# Altium schematic sheet Buck regulator.SchDoc
size A
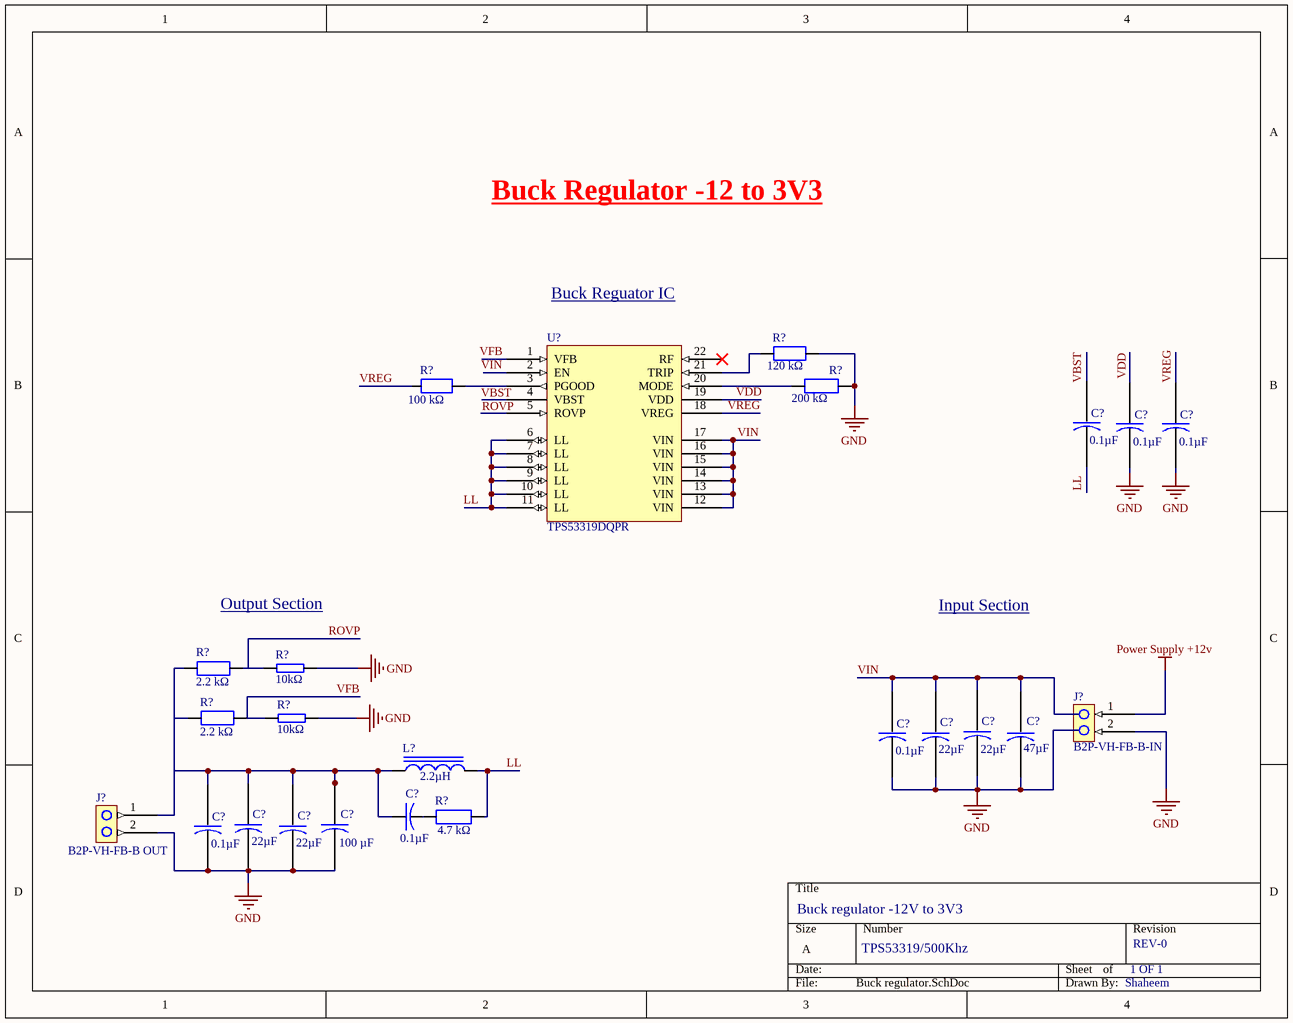
[diagram p0: Buck regulator.SchDoc]

## Parts
(Parts that share a designator on the sheet are numbered #1, #2 ... from top to bottom, then left to right.)
C?#1  0.1µF
C?#2  0.1µF
C?#3  0.1µF
C?#4  22µF
C?#5  22µF
C?#6  0.1µF
C?#7  47µF
C?#8  22µF
C?#9  22µF
C?#10  0.1µF
C?#11  100 µF
C?#12  0.1µF
J?#1  B2P-VH-FB-B-IN
J?#2  B2P-VH-FB-B OUT
L?  2.2µH
R?#1  120 kΩ
R?#2  100 kΩ
R?#3  200 kΩ
R?#4  2.2 kΩ  [RMCF0805FT2K20-2.2kohm Thick film resistor]
R?#5  10kΩ
R?#6  2.2 kΩ  [RMCF0805FT2K20-2.2kohm Thick film resistor]
R?#7  10kΩ
R?#8  4.7 kΩ
U?  TPS53319DQPR

## Nets
GND: C?#2.1 C?#3.1 C?#4.1 C?#5.1 C?#6.1 C?#7.1 C?#8.1 C?#9.1 C?#11.1 C?#12.1 J?#1.2 J?#2.2 R?#1.1 R?#3.2 R?#5.1 R?#7.1
Power Supply +12v: J?#1.1
LL: L?.2 R?#8.1
ROVP: R?#4.1 R?#5.2
VDD: C?#2.2 U?.19(VDD)
VFB: R?#6.1 R?#7.2
VIN: C?#4.2 C?#5.2 C?#6.2 C?#7.2 U?.12(VIN) U?.13(VIN) U?.14(VIN) U?.15(VIN) U?.16(VIN) U?.17(VIN)
VREG: R?#2.2 U?.18(VREG)
NetC?#8_2: C?#8.2 C?#9.2 C?#10.2 C?#11.2 C?#12.2 J?#2.1 L?.1 R?#4.2 R?#6.2
NetC?#10_1: C?#10.1 R?#8.2
NetR?#1_2: R?#1.2 U?.21(TRIP)
NetR?#2_1: R?#2.1 U?.3(PGOOD)
NetR?#3_1: R?#3.1 U?.20(MODE)
NetU?_6: U?.6(LL) U?.7(LL) U?.8(LL) U?.9(LL) U?.10(LL) U?.11(LL)

Not connected (* = marked no-connect by the designer): C?#1 1 2; C?#3 2; U? 1(VFB) 2(EN) 4(VBST) 5(ROVP) 22(RF)*

## Notes on the sheet
- Buck Regulator -12 to 3V3
- Buck Reguator IC
- Output Section
- Input Section
- Buck regulator -12V to 3V3
- TPS53319/500Khz
- 1 OF 1
- REV-0
- Shaheem
- Labels drawn without touching a wire or pin: LL, ROVP, VBST, VFB, VIN, VREG

## Library data of the parts
C?#1-C?#3 C?#6 C?#10 C?#12 = GRM155R71E104KE14J- 0.1 µF: 0402 0.1 uF 25 V ±10% Tolerance X7R SMT Multilayer Ceramic Capacitor; Manufacturer: Murata; Manufacturer Lifecycle Status: IN PRODUCTION; Value: 100nF; Voltage Rating: 25V; Supplier: DigiKey; Supplier Part Number: 490-14603-2-ND; Manufacturer Part Number: GRM155R71E104KE14J; RoHS: Compliant; Category: Ceramic Capacitors; Stock: 1424920; Pricing: 50000=0.00435, 100000=0.00402, 150000=0.00386, 250000=0.00368, 350000=0.00357, 500000=0.00347 (USD); Case/Package: 0402; Case Code (Imperial): 0402; Case Code (Metric): 1005; Composition: Ceramic; Dielectric: X7R; Dielectric Material: Ceramic; Height: 500µm; Length: 1mm; Lifecycle Status: Production; Material: Ceramic; Max Operating Temperature: 125°C; Min Operating Temperature: -55°C; Mounting Technology: Surface Mount; Pins: 2; Number of Terminals: 2; Packaging: Tape & Reel (TR); REACH SVHC: Yes; Schedule B: 8532240020, 8532240020|8532240020, 8532240020|8532240020|8532240020, 8532240020|8532240020|8532240020|8532240020; Termination: SMD/SMT; Thickness: 500µm; Tolerance: 10%; Voltage Rating (DC): 25V; Weight: 6.010099mg; Width: 500µm; ComponentLink1URL: https://datasheet.octopart.com:443/GRM155R71E104KE14J-Murata-datasheet-155345056.pdf?src-supplier=Newark; ComponentLink1Description: https://datasheet.octopart.com:443/GRM155R71E104KE14J-Murata-datasheet-155345056.pdf?src-supplier=Newark; ComponentLink2URL: https://datasheet.octopart.com:443/GRM155R71E104KE14J-Murata-datasheet-165579666.pdf?src-supplier=TME; ComponentLink2Description: https://datasheet.octopart.com:443/GRM155R71E104KE14J-Murata-datasheet-165579666.pdf?src-supplier=TME; ComponentLink3URL: https://datasheet.octopart.com:443/GRM155R71E104KE14J-Murata-datasheet-141266224.pdf?src-supplier=Ciiva; ComponentLink3Description: https://datasheet.octopart.com:443/GRM155R71E104KE14J-Murata-datasheet-141266224.pdf?src-supplier=Ciiva; ComponentLink4URL: https://datasheet.octopart.com:443/GRM155R71E104KE14J-Murata-datasheet-140691366.pdf?src-supplier=Ciiva; ComponentLink4Description: https://datasheet.octopart.com:443/GRM155R71E104KE14J-Murata-datasheet-140691366.pdf?src-supplier=Ciiva; ComponentLink5URL: https://datasheet.octopart.com:443/GRM155R71E104KE14J-Murata-datasheet-138740936.pdf?src-supplier=Ciiva; ComponentLink5Description: https://datasheet.octopart.com:443/GRM155R71E104KE14J-Murata-datasheet-138740936.pdf?src-supplier=Ciiva; ComponentLink6URL: https://datasheet.octopart.com/GRM155R71E104KE14J-Murata-datasheet-12515295.pdf; ComponentLink6Description: https://datasheet.octopart.com/GRM155R71E104KE14J-Murata-datasheet-12515295.pdf; ComponentLink7URL: https://datasheet.octopart.com/GRM155R71E104KE14J-Murata-datasheet-12510076.pdf; ComponentLink7Description: https://datasheet.octopart.com/GRM155R71E104KE14J-Murata-datasheet-12510076.pdf; ComponentLink8URL: https://datasheet.octopart.com/GRM155R71E104KE14J-Murata-datasheet-11978611.pdf; ComponentLink8Description: https://datasheet.octopart.com/GRM155R71E104KE14J-Murata-datasheet-11978611.pdf; ComponentLink9URL: https://datasheet.octopart.com/GRM155R71E104KE14J-Murata-datasheet-10025737.pdf; ComponentLink9Description: https://datasheet.octopart.com/GRM155R71E104KE14J-Murata-datasheet-10025737.pdf; ComponentLink10URL: https://datasheet.octopart.com/GRM155R71E104KE14J-Murata-datasheet-8819587.pdf; ComponentLink10Description: https://datasheet.octopart.com/GRM155R71E104KE14J-Murata-datasheet-8819587.pdf; ComponentLink11URL: https://datasheet.octopart.com/GRM155R71E104KE14J-Murata-datasheet-15634843.pdf; ComponentLink11Description: https://datasheet.octopart.com/GRM155R71E104KE14J-Murata-datasheet-15634843.pdf; ComponentLink12URL: https://datasheet.octopart.com:443/GRM155R71E104KE14J-Murata-datasheet-144363483.pdf?src-supplier=Arrow.cn; ComponentLink12Description: https://datasheet.octopart.com:443/GRM155R71E104KE14J-Murata-datasheet-144363483.pdf?src-supplier=Arrow.cn; ComponentLink13URL: http://sigma.octopart.com:80/reach_statement/Murata-company-16.pdf?src-supplier=Compliance+Statements; ComponentLink13Description: http://sigma.octopart.com:80/reach_statement/Murata-company-16.pdf?src-supplier=Compliance+Statements; Supplier 1: DigiKey; Supplier Part Number 1: 490-14603-1-ND
C?#4 C?#5 C?#8 C?#9 = GRM32ER71E226KE15L-22 µF: 25V 22µF X7R ±10% 1210 Multilayer Ceramic Capacitors MLCC - SMD/SMT ROHS; Manufacturer: Murata; Manufacturer Lifecycle Status: IN PRODUCTION; Color: Black; Current Rating: 3A; Gender: Male; Supplier: DigiKey; Supplier Part Number: 490-5313-6-ND; Manufacturer Part Number: GRM32ER71E226KE15L; RoHS: Compliant; Category: Ceramic Capacitors; Stock: 107975; Pricing: 1=0.76, 10=0.477, 50=0.3648, 100=0.3303, 500=0.27204 (USD); Value: 22µF; Case/Package: 1210; Case Code (Imperial): 1210; Case Code (Metric): 3225; Contact Material: Bronze; Contact Plating: Gold; Country of Origin: Singapore; Depth: 2.5mm; Dielectric: X7R; Dielectric Material: Ceramic; Export Control Classification Number (ECCN) Code: EAR99; Height: 2.5mm; Harmonized Tariff Schedule (HTS) Code: 8532.24.00.20; Introduction Date: 2009-02-19; Lead Free: Lead Free; Lead Pitch: 2.54mm; Length: 3.2mm; Lifecycle Status: Production; Material: Ceramic; Max Operating Temperature: 125°C; Min Operating Temperature: -55°C; Mounting Technology: Surface Mount; Pins: 2; Number of Terminals: 2; Packaging: Cut Tape; Radiation Hardening: No; REACH SVHC: Yes; Schedule B: 8532240020, 8532240020|8532240020, 8532240020|8532240020|8532240020, 8532240020|8532240020|8532240020|8532240020; Termination: SMD/SMT; Thickness: 2.5mm; Tolerance: 10%; Voltage: 25V; Voltage Rating: 25V; Voltage Rating (DC): 25V; Width: 2.5mm; ComponentLink1URL: https://datasheet.octopart.com:443/GRM32ER71E226KE15L-Murata-datasheet-141422401.pdf?src-supplier=Upverter; ComponentLink1Description: https://datasheet.octopart.com:443/GRM32ER71E226KE15L-Murata-datasheet-141422401.pdf?src-supplier=Upverter; ComponentLink2URL: https://datasheet.octopart.com:443/GRM32ER71E226KE15L-Murata-datasheet-12536533.pdf?src-supplier=Factory+Futures; ComponentLink2Description: https://datasheet.octopart.com:443/GRM32ER71E226KE15L-Murata-datasheet-12536533.pdf?src-supplier=Factory+Futures; ComponentLink3URL: https://datasheet.octopart.com:443/GRM32ER71E226KE15L-Murata-datasheet-62317415.pdf?src-supplier=element14+APAC; ComponentLink3Description: https://datasheet.octopart.com:443/GRM32ER71E226KE15L-Murata-datasheet-62317415.pdf?src-supplier=element14+APAC; ComponentLink4URL: https://datasheet.octopart.com:443/GRM32ER71E226KE15L-Murata-datasheet-14713250.pdf?src-supplier=element14+APAC; ComponentLink4Description: https://datasheet.octopart.com:443/GRM32ER71E226KE15L-Murata-datasheet-14713250.pdf?src-supplier=element14+APAC; ComponentLink5URL: https://datasheet.octopart.com:443/GRM32ER71E226KE15L-Murata-datasheet-141281608.pdf?src-supplier=Geoflip; ComponentLink5Description: https://datasheet.octopart.com:443/GRM32ER71E226KE15L-Murata-datasheet-141281608.pdf?src-supplier=Geoflip; ComponentLink6URL: https://datasheet.octopart.com:443/GRM32ER71E226KE15L-Murata-datasheet-8814637.pdf?src-supplier=Newark; ComponentLink6Description: https://datasheet.octopart.com:443/GRM32ER71E226KE15L-Murata-datasheet-8814637.pdf?src-supplier=Newark; ComponentLink7URL: https://datasheet.octopart.com:443/GRM32ER71E226KE15L-Murata-datasheet-14403038.pdf?src-supplier=Future+Electronics; ComponentLink7Description: https://datasheet.octopart.com:443/GRM32ER71E226KE15L-Murata-datasheet-14403038.pdf?src-supplier=Future+Electronics; ComponentLink8URL: https://datasheet.octopart.com:443/GRM32ER71E226KE15L-Murata-datasheet-22122223.pdf?src-supplier=Future+Electronics; ComponentLink8Description: https://datasheet.octopart.com:443/GRM32ER71E226KE15L-Murata-datasheet-22122223.pdf?src-supplier=Future+Electronics; ComponentLink9URL: https://datasheet.octopart.com:443/GRM32ER71E226KE15L-Murata-datasheet-165579666.pdf?src-supplier=TME; ComponentLink9Description: https://datasheet.octopart.com:443/GRM32ER71E226KE15L-Murata-datasheet-165579666.pdf?src-supplier=TME; ComponentLink10URL: https://datasheet.octopart.com:443/GRM32ER71E226KE15L-Murata-datasheet-59876780.pdf?src-supplier=TME; ComponentLink10Description: https://datasheet.octopart.com:443/GRM32ER71E226KE15L-Murata-datasheet-59876780.pdf?src-supplier=TME; ComponentLink11URL: https://datasheet.octopart.com:443/GRM32ER71E226KE15L-Murata-datasheet-140709638.pdf?src-supplier=Ciiva; ComponentLink11Description: https://datasheet.octopart.com:443/GRM32ER71E226KE15L-Murata-datasheet-140709638.pdf?src-supplier=Ciiva; ComponentLink12URL: https://datasheet.octopart.com:443/GRM32ER71E226KE15L-Murata-datasheet-138747041.pdf?src-supplier=Ciiva; ComponentLink12Description: https://datasheet.octopart.com:443/GRM32ER71E226KE15L-Murata-datasheet-138747041.pdf?src-supplier=Ciiva; ComponentLink13URL: https://datasheet.octopart.com/GRM32ER71E226KE15L-Murata-datasheet-12515295.pdf; ComponentLink13Description: https://datasheet.octopart.com/GRM32ER71E226KE15L-Murata-datasheet-12515295.pdf; ComponentLink14URL: https://datasheet.octopart.com/GRM32ER71E226KE15L-Murata-datasheet-12510076.pdf; ComponentLink14Description: https://datasheet.octopart.com/GRM32ER71E226KE15L-Murata-datasheet-12510076.pdf; ComponentLink15URL: https://datasheet.octopart.com/GRM32ER71E226KE15L-Murata-datasheet-11978611.pdf; ComponentLink15Description: https://datasheet.octopart.com/GRM32ER71E226KE15L-Murata-datasheet-11978611.pdf; ComponentLink16URL: https://datasheet.octopart.com/GRM32ER71E226KE15L-Murata-datasheet-10025737.pdf; ComponentLink16Description: https://datasheet.octopart.com/GRM32ER71E226KE15L-Murata-datasheet-10025737.pdf; ComponentLink17URL: https://datasheet.octopart.com/GRM32ER71E226KE15L-Murata-datasheet-8819587.pdf; ComponentLink17Description: https://datasheet.octopart.com/GRM32ER71E226KE15L-Murata-datasheet-8819587.pdf; ComponentLink18URL: http://sigma.octopart.com:80/reach_statement/Murata-company-16.pdf?src-supplier=Compliance+Statements; ComponentLink18Description: http://sigma.octopart.com:80/reach_statement/Murata-company-16.pdf?src-supplier=Compliance+Statements; Supplier 1: DigiKey; Supplier Part Number 1: 490-5313-6-ND
C?#7 = A768EB476M1ELAS042: Tant Poly Cap, 47 Uf, 25V, 1.175A, Solder Rohs Compliant: Yes |Kemet A768EB476M1ELAS042; Manufacturer: Yageo Group; ESR (Equivalent Series Resistance): 42mΩ; Leakage Current: 235µA; Ripple Current: 58.75mA; ComponentLink6URL: https://datasheet.octopart.com:443/EEHZK1E471P-Panasonic-datasheet-137716607.pdf?src-supplier=TME; ComponentLink6Description: https://datasheet.octopart.com:443/EEHZK1E471P-Panasonic-datasheet-137716607.pdf?src-supplier=TME; Supplier: DigiKey; Supplier Part Number: 399-A768EB476M1ELAS042CT-ND; Manufacturer Part Number: A768EB476M1ELAS042; RoHS: Compliant; Category: Aluminum Electrolytic Capacitors; Stock: 8816; Pricing: 1=0.54, 10=0.337, 50=0.2494, 100=0.2218, 500=0.17396 (USD); Value: 47µF; Export Control Classification Number (ECCN) Code: EAR99; Height: 5.7mm; Introduction Date: 2020-02-04; Length: 6.6mm; Lifecycle Status: Production; Max Operating Temperature: 125°C; Min Operating Temperature: -55°C; Mounting Technology: Surface Mount; Number of Terminals: 2; Ratings: AEC-Q200; REACH SVHC: Yes; Voltage Rating (DC): 25V; Width: 6.6mm; ComponentLink1URL: https://datasheet.octopart.com:443/A768EB476M1ELAS042-KEMET-datasheet-182036773.pdf?src-supplier=IHS; ComponentLink1Description: https://datasheet.octopart.com:443/A768EB476M1ELAS042-KEMET-datasheet-182036773.pdf?src-supplier=IHS; ComponentLink2URL: https://datasheet.octopart.com:443/A768EB476M1ELAS042-KEMET-datasheet-192944601.pdf?src-supplier=element14+APAC; ComponentLink2Description: https://datasheet.octopart.com:443/A768EB476M1ELAS042-KEMET-datasheet-192944601.pdf?src-supplier=element14+APAC; Supplier 1: DigiKey; Supplier Part Number 1: 399-A768EB476M1ELAS042CT-ND
C?#11 = RSL0J101MCN1GB: Cap Aluminum Polymer 100uF 6.3VDC 20% (6.3 X 4.2mm) SMD 0.018 Ohm 3200mA 2000h 105C T/R; Manufacturer: KYOCERA AVX; Value: 100µF; Dissipation Factor: 0.12%; ESR (Equivalent Series Resistance): 18mΩ; Leakage Current: 315µA; Life (Hours): 2000hours; Ripple Current: 320mA; Ripple Current (AC): 3.2A; Voltage Rating: 6.3V; Supplier: DigiKey; Supplier Part Number: 493-3819-2-ND; Manufacturer Part Number: RSL0J101MCN1GB; RoHS: Compliant; Category: Aluminum Electrolytic Capacitors; Stock: 490; Pricing: 1000=0.4217, 2000=0.39459, 3000=0.38092, 5000=0.36567, 7000=0.35671, 10000=0.34806 (USD); Case/Package: Radial; China RoHS: Compliant; Country of Origin: Mainland China; Diameter: 6.3mm; Export Control Classification Number (ECCN) Code: EAR99; Height: 4.2mm; Height - Seated (Max): 4.191mm; Harmonized Tariff Schedule (HTS) Code: 8532.22.00; Introduction Date: 2009-11-05; Length: 6.5mm; Lifecycle Status: Production; Max Operating Temperature: 105°C; Min Operating Temperature: -55°C; Mounting Technology: Surface Mount; Number of Terminals: 2; Packaging: Tape & Reel; REACH SVHC: Yes; Schedule B: 8532220020; Termination: SMD/SMT; Tolerance: 20%; Voltage Rating (DC): 6.3V; Width: 6.5mm; ComponentLink1URL: https://datasheet.octopart.com:443/RSL0J101MCN1GB-Nichicon-datasheet-169479674.pdf?src-supplier=IHS; ComponentLink1Description: https://datasheet.octopart.com:443/RSL0J101MCN1GB-Nichicon-datasheet-169479674.pdf?src-supplier=IHS; ComponentLink2URL: https://datasheet.octopart.com:443/RSL0J101MCN1GB-Nichicon-datasheet-12517196.pdf?src-supplier=Newark; ComponentLink2Description: https://datasheet.octopart.com:443/RSL0J101MCN1GB-Nichicon-datasheet-12517196.pdf?src-supplier=Newark; ComponentLink3URL: https://datasheet.octopart.com:443/RSL0J101MCN1GB-Nichicon-datasheet-65933903.pdf?src-supplier=Newark; ComponentLink3Description: https://datasheet.octopart.com:443/RSL0J101MCN1GB-Nichicon-datasheet-65933903.pdf?src-supplier=Newark; ComponentLink4URL: https://datasheet.octopart.com:443/RSL0J101MCN1GB-Nichicon-datasheet-182387194.pdf?src-supplier=Future+Electronics; ComponentLink4Description: https://datasheet.octopart.com:443/RSL0J101MCN1GB-Nichicon-datasheet-182387194.pdf?src-supplier=Future+Electronics; ComponentLink5URL: https://datasheet.octopart.com:443/RSL0J101MCN1GB-Nichicon-datasheet-161351370.pdf?src-supplier=Future+Electronics; ComponentLink5Description: https://datasheet.octopart.com:443/RSL0J101MCN1GB-Nichicon-datasheet-161351370.pdf?src-supplier=Future+Electronics; ComponentLink6URL: https://datasheet.octopart.com:443/RSL0J101MCN1GB-Nichicon-datasheet-145428908.pdf?src-supplier=Nichicon+SCT; ComponentLink6Description: https://datasheet.octopart.com:443/RSL0J101MCN1GB-Nichicon-datasheet-145428908.pdf?src-supplier=Nichicon+SCT; ComponentLink7URL: https://datasheet.octopart.com:443/RSL0J101MCN1GB-Nichicon-datasheet-140570125.pdf?src-supplier=Arrow.cn; ComponentLink7Description: https://datasheet.octopart.com:443/RSL0J101MCN1GB-Nichicon-datasheet-140570125.pdf?src-supplier=Arrow.cn; Supplier 1: DigiKey; Supplier Part Number 1: 493-3819-2-ND
J?#1 = B2P-VH-FB-B: Conn Shrouded Header (4 Sides) HDR 2 POS 3.96mm Solder ST Top Entry Thru-Hole Box; Manufacturer: JST; Manufacturer Part Number: B2P-VH-FB-B(LF)(SN); Connector Type: Male Pin; Current Rating: 10A; Gender: Male; Number of Contacts: 2; Pitch: 3.9624mm; Voltage Rating: 250V; Supplier 1: Future Electronics; Supplier Part Number 1: B2P-VH-FB-B(LF)(SN); Supplier: Future Electronics; Supplier Part Number: B2P-VH-FB-B(LF)(SN); RoHS: Compliant; Category: Headers and Wire Housings; Stock: 2504; Pricing: 250=0.11, 1000=0.106, 2500=0.104, 6250=0.101, 10000=0.0975 (USD); China RoHS: Compliant; Color: Natural; Contact Material: Brass; Contact Plating: Tin; Country of Origin: Indonesia; Export Control Classification Number (ECCN) Code: EAR99; Fastening Type: Ramp; Height: 11mm; Harmonized Tariff Schedule (HTS) Code: 8536.69.40.40; Introduction Date: 2010-03-26; Lead Free: Lead Free; Lifecycle Status: Production; Max Operating Temperature: 85°C; Min Operating Temperature: -25°C; Mounting Technology: Through Hole; Pins: 2; Number of Positions: 2; Number of Rows: 1; Orientation: Straight; REACH SVHC: Yes; Terminal Pitch: 3.96mm; Termination: Solder; ComponentLink1URL: https://datasheet.octopart.com:443/B2P-VH-FB-B%28LF%29%28SN%29-JST-datasheet-41193408.pdf?src-supplier=IHS; ComponentLink1Description: https://datasheet.octopart.com:443/B2P-VH-FB-B%28LF%29%28SN%29-JST-datasheet-41193408.pdf?src-supplier=IHS; ComponentLink2URL: https://datasheet.octopart.com:443/B2P-VH-FB-B%28LF%29%28SN%29-JST-datasheet-151658475.pdf?src-supplier=LKR; ComponentLink2Description: https://datasheet.octopart.com:443/B2P-VH-FB-B%28LF%29%28SN%29-JST-datasheet-151658475.pdf?src-supplier=LKR; ComponentLink3URL: https://datasheet.octopart.com:443/B2P-VH-FB-B%28LF%29%28SN%29-JST-datasheet-12513069.pdf?src-supplier=Future+Electronics; ComponentLink3Description: https://datasheet.octopart.com:443/B2P-VH-FB-B%28LF%29%28SN%29-JST-datasheet-12513069.pdf?src-supplier=Future+Electronics; ComponentLink4URL: https://datasheet.octopart.com:443/B2P-VH-FB-B%28LF%29%28SN%29-JST-datasheet-10025879.pdf?src-supplier=Future+Electronics; ComponentLink4Description: https://datasheet.octopart.com:443/B2P-VH-FB-B%28LF%29%28SN%29-JST-datasheet-10025879.pdf?src-supplier=Future+Electronics; ComponentLink5URL: https://datasheet.octopart.com:443/B2P-VH-FB-B%28LF%29%28SN%29-JST-datasheet-5332680.pdf?src-supplier=Future+Electronics; ComponentLink5Description: https://datasheet.octopart.com:443/B2P-VH-FB-B%28LF%29%28SN%29-JST-datasheet-5332680.pdf?src-supplier=Future+Electronics; ComponentLink6URL: https://datasheet.octopart.com:443/B2P-VH-FB-B%28LF%29%28SN%29-JST-datasheet-16979.pdf?src-supplier=Future+Electronics; ComponentLink6Description: https://datasheet.octopart.com:443/B2P-VH-FB-B%28LF%29%28SN%29-JST-datasheet-16979.pdf?src-supplier=Future+Electronics
J?#2 = B2P-VH-FB-B OUT: Conn Shrouded Header (4 Sides) HDR 2 POS 3.96mm Solder ST Top Entry Thru-Hole Box; Manufacturer: JST; Manufacturer Part Number: B2P-VH-FB-B(LF)(SN); Connector Type: Male Pin; Current Rating: 10A; Gender: Male; Number of Contacts: 2; Pitch: 3.9624mm; Voltage Rating: 250V; Supplier: Future Electronics; Supplier Part Number: B2P-VH-FB-B(LF)(SN); RoHS: Compliant; Category: Headers and Wire Housings; Stock: 2504; Pricing: 250=0.11, 1000=0.106, 2500=0.104, 6250=0.101, 10000=0.0975 (USD); China RoHS: Compliant; Color: Natural; Contact Material: Brass; Contact Plating: Tin; Country of Origin: Indonesia; Export Control Classification Number (ECCN) Code: EAR99; Fastening Type: Ramp; Height: 11mm; Harmonized Tariff Schedule (HTS) Code: 8536.69.40.40; Introduction Date: 2010-03-26; Lead Free: Lead Free; Lifecycle Status: Production; Max Operating Temperature: 85°C; Min Operating Temperature: -25°C; Mounting Technology: Through Hole; Pins: 2; Number of Positions: 2; Number of Rows: 1; Orientation: Straight; REACH SVHC: Yes; Terminal Pitch: 3.96mm; Termination: Solder; ComponentLink1URL: https://datasheet.octopart.com:443/B2P-VH-FB-B%28LF%29%28SN%29-JST-datasheet-41193408.pdf?src-supplier=IHS; ComponentLink1Description: https://datasheet.octopart.com:443/B2P-VH-FB-B%28LF%29%28SN%29-JST-datasheet-41193408.pdf?src-supplier=IHS; ComponentLink2URL: https://datasheet.octopart.com:443/B2P-VH-FB-B%28LF%29%28SN%29-JST-datasheet-151658475.pdf?src-supplier=LKR; ComponentLink2Description: https://datasheet.octopart.com:443/B2P-VH-FB-B%28LF%29%28SN%29-JST-datasheet-151658475.pdf?src-supplier=LKR; ComponentLink3URL: https://datasheet.octopart.com:443/B2P-VH-FB-B%28LF%29%28SN%29-JST-datasheet-12513069.pdf?src-supplier=Future+Electronics; ComponentLink3Description: https://datasheet.octopart.com:443/B2P-VH-FB-B%28LF%29%28SN%29-JST-datasheet-12513069.pdf?src-supplier=Future+Electronics; ComponentLink4URL: https://datasheet.octopart.com:443/B2P-VH-FB-B%28LF%29%28SN%29-JST-datasheet-10025879.pdf?src-supplier=Future+Electronics; ComponentLink4Description: https://datasheet.octopart.com:443/B2P-VH-FB-B%28LF%29%28SN%29-JST-datasheet-10025879.pdf?src-supplier=Future+Electronics; ComponentLink5URL: https://datasheet.octopart.com:443/B2P-VH-FB-B%28LF%29%28SN%29-JST-datasheet-5332680.pdf?src-supplier=Future+Electronics; ComponentLink5Description: https://datasheet.octopart.com:443/B2P-VH-FB-B%28LF%29%28SN%29-JST-datasheet-5332680.pdf?src-supplier=Future+Electronics; ComponentLink6URL: https://datasheet.octopart.com:443/B2P-VH-FB-B%28LF%29%28SN%29-JST-datasheet-16979.pdf?src-supplier=Future+Electronics; ComponentLink6Description: https://datasheet.octopart.com:443/B2P-VH-FB-B%28LF%29%28SN%29-JST-datasheet-16979.pdf?src-supplier=Future+Electronics; Supplier 1: Future Electronics; Supplier Part Number 1: B2P-VH-FB-B(LF)(SN)
L? = 0640CDMCCDS-2R2MC: Inductor Power Shielded/Molded Wirewound 2.2uH 20% 100KHz Metal 12A 0.0108Ohm DCR T/R; Manufacturer: Sumida; DC Resistance (DCR): 10.8mΩ; Number of Circuits: 1; Supplier: DigiKey; Supplier Part Number: 308-0640CDMCCDS-2R2MCCT-ND; Manufacturer Part Number: 0640CDMCCDS-2R2MC; RoHS: Compliant; Category: Fixed Inductors; Stock: 4702; Pricing: 1=0.78, 10=0.642, 100=0.5283 (USD); Case/Package: 2826; Height: 3.8mm; Value: 2.2µH; Length: 7mm; Lifecycle Status: Production; Max Current Rating: 12A; Max Operating Temperature: 125°C; Min Operating Temperature: -55°C; Number of Terminals: 2; Shielding: Shielded; Test Frequency: 100kHz; Tolerance: 20%; Width: 6.6mm; ComponentLink1URL: https://datasheet.octopart.com:443/0640CDMCCDS-2R2MC-Sumida-datasheet-181250634.pdf?src-supplier=IHS; ComponentLink1Description: https://datasheet.octopart.com:443/0640CDMCCDS-2R2MC-Sumida-datasheet-181250634.pdf?src-supplier=IHS; Supplier 1: DigiKey; Supplier Part Number 1: 308-0640CDMCCDS-2R2MCCT-ND
R?#1 = RC0603JR-07120KL: 120 kOhms ±5% 0.1W, 1/10W Chip Resistor 0603 (1608 Metric) Moisture Resistant Thick Film; Supplier 1: DigiKey; Supplier Part Number 1: 311-120KGRDKR-ND
R?#2 = RG1608N-104-W-T5: Fixed Resistor, Thin Film, 0.167W, 100000ohm, 100V, 0.05% +/-Tol, Surface Mount, 0603; Manufacturer: Susumu; Max Power Dissipation: 100mW; Value: 100kΩ; Temperature Coefficient: 10ppm/°C; Voltage Rating (DC): 75V; Supplier: DigiKey; Supplier Part Number: 408-RG1608N-104-W-T5DKR-ND; Manufacturer Part Number: RG1608N-104-W-T5; RoHS: Compliant; Category: Chip SMD Resistors; Stock: 13100; Pricing: 1=0.57, 10=0.476, 25=0.4416, 50=0.4172, 100=0.3948, 250=0.3678, 500=0.34958, 1000=0.33318 (USD); Case/Package: 0603; Case Code (Imperial): 0603; Case Code (Metric): 1608; Composition: Thin Film; Features: Automotive AEC-Q200; Height: 400µm; Lead Free: Lead Free; Length: 1.6mm; Lifecycle Status: Production; Max Operating Temperature: 155°C; Min Operating Temperature: -55°C; Mounting Technology: Surface Mount; Number of Terminals: 2; Number of Terminations: 2; Packaging: Tape & Reel (TR); Power Rating: 100mW; Ratings: AEC-Q200; REACH SVHC: Yes; Termination: SMD/SMT; Tolerance: 0.05%; Voltage Rating: 100V; Width: 800µm; Working Voltage: 100V; ComponentLink1URL: https://datasheet.octopart.com:443/RG1608N-104-W-T5-Susumu-datasheet-182148308.pdf?src-supplier=IHS; ComponentLink1Description: https://datasheet.octopart.com:443/RG1608N-104-W-T5-Susumu-datasheet-182148308.pdf?src-supplier=IHS; ComponentLink2URL: https://datasheet.octopart.com:443/RG1608N-104-W-T5-Susumu-datasheet-104167497.pdf?src-supplier=Upverter; ComponentLink2Description: https://datasheet.octopart.com:443/RG1608N-104-W-T5-Susumu-datasheet-104167497.pdf?src-supplier=Upverter; ComponentLink3URL: https://datasheet.octopart.com/RG1608N-104-W-T5-Susumu-datasheet-12509734.pdf; ComponentLink3Description: https://datasheet.octopart.com/RG1608N-104-W-T5-Susumu-datasheet-12509734.pdf; ComponentLink4URL: https://datasheet.octopart.com:443/RG1608N-104-W-T5-Susumu-datasheet-12510050.pdf?src-supplier=Future+Electronics; ComponentLink4Description: https://datasheet.octopart.com:443/RG1608N-104-W-T5-Susumu-datasheet-12510050.pdf?src-supplier=Future+Electronics; ComponentLink5URL: https://datasheet.octopart.com:443/RG1608N-104-W-T5-Susumu-datasheet-118552.pdf?src-supplier=DigiKey; ComponentLink5Description: https://datasheet.octopart.com:443/RG1608N-104-W-T5-Susumu-datasheet-118552.pdf?src-supplier=DigiKey; Supplier 1: DigiKey; Supplier Part Number 1: 408-RG1608N-104-W-T5DKR-ND
R?#3 = RG1608N-204-W-T1: TR / Thin Film Chip Resistors 0603 size, 1/16W, 200000 ohm, 0.05%, 10ppm; Manufacturer: Susumu; Max Power Dissipation: 100mW; Value: 200kΩ; Temperature Coefficient: 10ppm/°C; Voltage Rating: 75V; Supplier: DigiKey; Supplier Part Number: RG16N200KWTR-ND; Manufacturer Part Number: RG1608N-204-W-T1; RoHS: Compliant; Category: Chip SMD Resistors; Stock: 4919; Pricing: 1000=0.37889, 2000=0.3623, 3000=0.35347, 5000=0.34321, 7000=0.33696, 10000=0.33075 (USD); Case/Package: 0603; Case Code (Imperial): 0603; Case Code (Metric): 1608; Composition: Metal Film; Country of Origin: Mainland China, Japan; Export Control Classification Number (ECCN) Code: EAR99; Features: Automotive AEC-Q200; Height: 400µm; Harmonized Tariff Schedule (HTS) Code: 8533.21.00.30; Introduction Date: 2006-03-30; Lead Free: Lead Free; Length: 1.6mm; Lifecycle Status: Obsolete; Max Operating Temperature: 155°C; Min Operating Temperature: -55°C; Mounting Technology: Surface Mount; Number of Terminals: 2; Number of Terminations: 2; Packaging: Cut Tape; Power Rating: 100mW; Termination: SMD/SMT; Tolerance: 0.05%; Voltage Rating (DC): 75V; Width: 800µm; Working Voltage: 75V; ComponentLink1URL: https://datasheet.octopart.com:443/RG1608N-204-W-T1-Susumu-datasheet-17595413.pdf?src-supplier=IHS; ComponentLink1Description: https://datasheet.octopart.com:443/RG1608N-204-W-T1-Susumu-datasheet-17595413.pdf?src-supplier=IHS; ComponentLink2URL: https://datasheet.octopart.com:443/RG1608N-204-W-T1-Susumu-datasheet-62085167.pdf?src-supplier=Future+Electronics; ComponentLink2Description: https://datasheet.octopart.com:443/RG1608N-204-W-T1-Susumu-datasheet-62085167.pdf?src-supplier=Future+Electronics; ComponentLink3URL: https://datasheet.octopart.com/RG1608N-204-W-T1-Susumu-datasheet-12509734.pdf; ComponentLink3Description: https://datasheet.octopart.com/RG1608N-204-W-T1-Susumu-datasheet-12509734.pdf; ComponentLink4URL: https://datasheet.octopart.com:443/RG1608N-204-W-T1-Susumu-datasheet-118552.pdf?src-supplier=DigiKey; ComponentLink4Description: https://datasheet.octopart.com:443/RG1608N-204-W-T1-Susumu-datasheet-118552.pdf?src-supplier=DigiKey; Supplier 1: DigiKey; Supplier Part Number 1: RG16N200KWTR-ND
R?#4 R?#6 = RMCF0805FT2K20-2.2Kohm: Res Thick Film 0805 2.2K Ohm 1% 0.125W ±100ppm/°C Molded SMD Paper T/R; Manufacturer: Stackpole Electronics; Manufacturer Package Identifier: 0805 (2012 metric); Max Power Dissipation: 125mW; Value: 2.2kΩ; Voltage Rating: 150V; Supplier: DigiKey; Supplier Part Number: RMCF0805FT2K20CT-ND; Manufacturer Part Number: RMCF0805FT2K20; RoHS: Compliant; Category: Chip SMD Resistors; Stock: 127490; Pricing: 1=0.1, 10=0.027, 25=0.0196, 50=0.0156, 100=0.0127, 250=0.00988, 500=0.00824, 1000=0.00697 (USD); Case/Package: 0805; Case Code (Imperial): 0805; Case Code (Metric): 2012; China RoHS: Non-Compliant; Composition: Thick Film; Contact Plating: Tin; Depth: 1.25mm; Features: Automotive AEC-Q200; Height: 500µm; Length: 2mm; Lifecycle Status: Production; Max Operating Temperature: 155°C; Military Standard: Not; Min Operating Temperature: -55°C; Mounting Technology: Surface Mount; Number of Terminals: 2; Number of Terminations: 2; Packaging: Cut Tape (CT); Power Rating: 125mW; Radiation Hardening: No; Ratings: AEC-Q200; REACH SVHC: Yes; Schedule B: 8533210045, 8533210045|8533210045|8533210045|8533210045|8533210045; Temperature Coefficient: 100ppm/°C; Tolerance: 1%; Width: 1.25mm; Working Voltage: 150V; ComponentLink1URL: https://datasheet.octopart.com:443/RMCF0805FT2K20-Stackpole-Electronics-datasheet-182148065.pdf?src-supplier=IHS; ComponentLink1Description: https://datasheet.octopart.com:443/RMCF0805FT2K20-Stackpole-Electronics-datasheet-182148065.pdf?src-supplier=IHS; ComponentLink2URL: https://datasheet.octopart.com:443/RMCF0805FT2K20-Stackpole-Electronics-datasheet-28504820.pdf?src-supplier=Upverter; ComponentLink2Description: https://datasheet.octopart.com:443/RMCF0805FT2K20-Stackpole-Electronics-datasheet-28504820.pdf?src-supplier=Upverter; ComponentLink3URL: https://datasheet.octopart.com:443/RMCF0805FT2K20-Stackpole-Electronics-datasheet-141193804.pdf?src-supplier=Master+Electronics; ComponentLink3Description: https://datasheet.octopart.com:443/RMCF0805FT2K20-Stackpole-Electronics-datasheet-141193804.pdf?src-supplier=Master+Electronics; ComponentLink4URL: https://datasheet.octopart.com:443/RMCF0805FT2K20-Stackpole-Electronics-datasheet-116606903.pdf?src-supplier=Master+Electronics; ComponentLink4Description: https://datasheet.octopart.com:443/RMCF0805FT2K20-Stackpole-Electronics-datasheet-116606903.pdf?src-supplier=Master+Electronics; ComponentLink5URL: https://datasheet.octopart.com:443/RMCF0805FT2K20-Stackpole-Electronics-datasheet-189104163.pdf?src-supplier=Master+Electronics; ComponentLink5Description: https://datasheet.octopart.com:443/RMCF0805FT2K20-Stackpole-Electronics-datasheet-189104163.pdf?src-supplier=Master+Electronics; ComponentLink6URL: https://datasheet.octopart.com:443/RMCF0805FT2K20-Stackpole-Electronics-datasheet-62091608.pdf?src-supplier=Stackpole+Electronics; ComponentLink6Description: https://datasheet.octopart.com:443/RMCF0805FT2K20-Stackpole-Electronics-datasheet-62091608.pdf?src-supplier=Stackpole+Electronics; ComponentLink7URL: https://datasheet.octopart.com:443/RMCF0805FT2K20-Stackpole-Electronics-datasheet-12534581.pdf?src-supplier=Stackpole+Electronics; ComponentLink7Description: https://datasheet.octopart.com:443/RMCF0805FT2K20-Stackpole-Electronics-datasheet-12534581.pdf?src-supplier=Stackpole+Electronics; ComponentLink8URL: https://datasheet.octopart.com:443/RMCF0805FT2K20-Stackpole-Electronics-datasheet-10788263.pdf?src-supplier=Stackpole+Electronics; ComponentLink8Description: https://datasheet.octopart.com:443/RMCF0805FT2K20-Stackpole-Electronics-datasheet-10788263.pdf?src-supplier=Stackpole+Electronics; ComponentLink9URL: https://datasheet.octopart.com:443/RMCF0805FT2K20-Stackpole-Electronics-datasheet-11546843.pdf?src-supplier=Arrow+Electronics; ComponentLink9Description: https://datasheet.octopart.com:443/RMCF0805FT2K20-Stackpole-Electronics-datasheet-11546843.pdf?src-supplier=Arrow+Electronics; ComponentLink10URL: http://sigma.octopart.com:80/15940719/materials_sheet/Stackpole-Electronics-RMCF0805FT2K20.pdf?src-supplier=Compliance+Statements; ComponentLink10Description: http://sigma.octopart.com:80/15940719/materials_sheet/Stackpole-Electronics-RMCF0805FT2K20.pdf?src-supplier=Compliance+Statements; ComponentLink11URL: http://sigma.octopart.com:80/141158212/rohs_statement/Stackpole-Electronics-RMCF0805FT2K20.pdf?src-supplier=Compliance+Statements; ComponentLink11Description: http://sigma.octopart.com:80/141158212/rohs_statement/Stackpole-Electronics-RMCF0805FT2K20.pdf?src-supplier=Compliance+Statements; ComponentLink12URL: http://sigma.octopart.com:80/141158211/reach_statement/Stackpole-Electronics-RMCF0805FT2K20.pdf?src-supplier=Compliance+Statements; ComponentLink12Description: http://sigma.octopart.com:80/141158211/reach_statement/Stackpole-Electronics-RMCF0805FT2K20.pdf?src-supplier=Compliance+Statements; Supplier 1: DigiKey; Supplier Part Number 1: RMCF0805FT2K20TR-ND
R?#5 R?#7 = RC0603FR-0710KL-10kohm Thin film: 100mW Thick Film Resistors ±100ppm/℃ ±1% 10kΩ 0603 Chip Resistor - Surface Mount ROHS; Manufacturer: Yageo Group; Temperature Coefficient: 100ppm/°C; Voltage Rating: 75V; Voltage Rating (DC): 50V; Supplier: DigiKey; Supplier Part Number: 311-10.0KHRTR-ND; Manufacturer Part Number: RC0603FR-0710KL; RoHS: Compliant; Category: Chip SMD Resistors; Stock: 11777314; Pricing: 5000=0.00469, 10000=0.00414, 15000=0.00387, 25000=0.00358, 35000=0.00342, 50000=0.00326 (USD); Case/Package: 0603; Case Code (Imperial): 0603; Case Code (Metric): 0603; China RoHS: Non-Compliant; Composition: Thick Film; Contact Plating: Tin; Depth: 800µm; Height: 450µm; Lead Free: Lead Free; Lead Pitch: 300µm; Length: 1.6mm; Lifecycle Status: Production; Max Operating Temperature: 155°C; Military Standard: Not; Min Operating Temperature: -55°C; Mounting Technology: Surface Mount; Pins: 2; Number of Terminals: 2; Packaging: Tape & Reel; Power Rating: 100mW; Radiation Hardening: No; REACH SVHC: Yes; Value: 10kΩ; Schedule B: 8533210045, 8533210045|8533210045|8533210045|8533210045|8533210045|8533210045|8533210045|8533210045|8533210045|8533210045|8533210045|8533210045|8533210045|8533210045|8533210045|8533210045|8533210045|8533210045|8533210045|8533210045|8533210045|8533210045|8533210045|85; Termination: SMD/SMT; Tolerance: 1%; Weight: 2.012816mg; Width: 800µm; Working Voltage: 75V; ComponentLink1URL: https://datasheet.octopart.com:443/RC0603FR-0710KL-Yageo-datasheet-175887523.pdf?src-supplier=IHS; ComponentLink1Description: https://datasheet.octopart.com:443/RC0603FR-0710KL-Yageo-datasheet-175887523.pdf?src-supplier=IHS; ComponentLink2URL: https://datasheet.octopart.com:443/RC0603FR-0710KL-Yageo-datasheet-103092701.pdf?src-supplier=Upverter; ComponentLink2Description: https://datasheet.octopart.com:443/RC0603FR-0710KL-Yageo-datasheet-103092701.pdf?src-supplier=Upverter; ComponentLink3URL: https://datasheet.octopart.com:443/RC0603FR-0710KL-Yageo-datasheet-98239111.pdf?src-supplier=Upverter; ComponentLink3Description: https://datasheet.octopart.com:443/RC0603FR-0710KL-Yageo-datasheet-98239111.pdf?src-supplier=Upverter; ComponentLink4URL: https://datasheet.octopart.com:443/RC0603FR-0710KL-Yageo-datasheet-141265859.pdf?src-supplier=Upverter; ComponentLink4Description: https://datasheet.octopart.com:443/RC0603FR-0710KL-Yageo-datasheet-141265859.pdf?src-supplier=Upverter; ComponentLink5URL: https://sigma.octopart.com:443/138820526/technical_drawing/Yageo-RC0603FR-0710KL.pdf?src-supplier=Upverter; ComponentLink5Description: https://sigma.octopart.com:443/138820526/technical_drawing/Yageo-RC0603FR-0710KL.pdf?src-supplier=Upverter; ComponentLink6URL: https://datasheet.octopart.com:443/RC0603FR-0710KL-Yageo-datasheet-8328172.pdf?src-supplier=Farnell; ComponentLink6Description: https://datasheet.octopart.com:443/RC0603FR-0710KL-Yageo-datasheet-8328172.pdf?src-supplier=Farnell; ComponentLink7URL: https://datasheet.octopart.com:443/RC0603FR-0710KL-Yageo-datasheet-13691069.pdf?src-supplier=Farnell; ComponentLink7Description: https://datasheet.octopart.com:443/RC0603FR-0710KL-Yageo-datasheet-13691069.pdf?src-supplier=Farnell; ComponentLink8URL: https://datasheet.octopart.com:443/RC0603FR-0710KL-Yageo-datasheet-62067350.pdf?src-supplier=element14+APAC; ComponentLink8Description: https://datasheet.octopart.com:443/RC0603FR-0710KL-Yageo-datasheet-62067350.pdf?src-supplier=element14+APAC; ComponentLink9URL: https://datasheet.octopart.com:443/RC0603FR-0710KL-Yageo-datasheet-17842380.pdf?src-supplier=element14+APAC; ComponentLink9Description: https://datasheet.octopart.com:443/RC0603FR-0710KL-Yageo-datasheet-17842380.pdf?src-supplier=element14+APAC; ComponentLink10URL: https://datasheet.octopart.com:443/RC0603FR-0710KL-Yageo-datasheet-15599030.pdf?src-supplier=Future+Electronics; ComponentLink10Description: https://datasheet.octopart.com:443/RC0603FR-0710KL-Yageo-datasheet-15599030.pdf?src-supplier=Future+Electronics; ComponentLink11URL: https://datasheet.octopart.com:443/RC0603FR-0710KL-Yageo-Group-datasheet-176638170.pdf?src-supplier=Future+Electronics; ComponentLink11Description: https://datasheet.octopart.com:443/RC0603FR-0710KL-Yageo-Group-datasheet-176638170.pdf?src-supplier=Future+Electronics; ComponentLink12URL: https://datasheet.octopart.com:443/RC0603FR-0710KL-Yageo-datasheet-164759695.pdf?src-supplier=Future+Electronics; ComponentLink12Description: https://datasheet.octopart.com:443/RC0603FR-0710KL-Yageo-datasheet-164759695.pdf?src-supplier=Future+Electronics; ComponentLink13URL: https://datasheet.octopart.com:443/RC0603FR-0710KL-Yageo-datasheet-127823281.pdf?src-supplier=Future+Electronics; ComponentLink13Description: https://datasheet.octopart.com:443/RC0603FR-0710KL-Yageo-datasheet-127823281.pdf?src-supplier=Future+Electronics; ComponentLink14URL: https://datasheet.octopart.com:443/RC0603FR-0710KL-Yageo-datasheet-137700087.pdf?src-supplier=Future+Electronics; ComponentLink14Description: https://datasheet.octopart.com:443/RC0603FR-0710KL-Yageo-datasheet-137700087.pdf?src-supplier=Future+Electronics; ComponentLink15URL: https://datasheet.octopart.com:443/RC0603FR-0710KL-Yageo-datasheet-27584510.pdf?src-supplier=Future+Electronics; ComponentLink15Description: https://datasheet.octopart.com:443/RC0603FR-0710KL-Yageo-datasheet-27584510.pdf?src-supplier=Future+Electronics; ComponentLink16URL: https://datasheet.octopart.com:443/RC0603FR-0710KL-Yageo-datasheet-8324193.pdf?src-supplier=Future+Electronics; ComponentLink16Description: https://datasheet.octopart.com:443/RC0603FR-0710KL-Yageo-datasheet-8324193.pdf?src-supplier=Future+Electronics; ComponentLink17URL: https://datasheet.octopart.com:443/RC0603FR-0710KL-Yageo-datasheet-12596169.pdf?src-supplier=Newark; ComponentLink17Description: https://datasheet.octopart.com:443/RC0603FR-0710KL-Yageo-datasheet-12596169.pdf?src-supplier=Newark; ComponentLink18URL: https://datasheet.octopart.com:443/RC0603FR-0710KL-Yageo-datasheet-503470.pdf?src-supplier=Newark; ComponentLink18Description: https://datasheet.octopart.com:443/RC0603FR-0710KL-Yageo-datasheet-503470.pdf?src-supplier=Newark; ComponentLink19URL: https://datasheet.octopart.com:443/RC0603FR-0710KL-Yageo-datasheet-34211833.pdf?src-supplier=Newark; ComponentLink19Description: https://datasheet.octopart.com:443/RC0603FR-0710KL-Yageo-datasheet-34211833.pdf?src-supplier=Newark; ComponentLink20URL: https://datasheet.octopart.com:443/RC0603FR-0710KL-Yageo-Group-datasheet-189192902.pdf?src-supplier=LCSC; ComponentLink20Description: https://datasheet.octopart.com:443/RC0603FR-0710KL-Yageo-Group-datasheet-189192902.pdf?src-supplier=LCSC; ComponentLink21URL: https://datasheet.octopart.com:443/RC0603FR-0710KL-Yageo-datasheet-79472498.pdf?src-supplier=Megastar; ComponentLink21Description: https://datasheet.octopart.com:443/RC0603FR-0710KL-Yageo-datasheet-79472498.pdf?src-supplier=Megastar; ComponentLink22URL: https://datasheet.octopart.com/RC0603FR-0710KL-Yageo-datasheet-73766026.pdf; ComponentLink22Description: https://datasheet.octopart.com/RC0603FR-0710KL-Yageo-datasheet-73766026.pdf; ComponentLink23URL: https://datasheet.octopart.com:443/RC0603FR-0710KL-Yageo-datasheet-118562.pdf?src-supplier=DigiKey; ComponentLink23Description: https://datasheet.octopart.com:443/RC0603FR-0710KL-Yageo-datasheet-118562.pdf?src-supplier=DigiKey; ComponentLink24URL: http://sigma.octopart.com:80/conflict_mineral_statement/Yageo-company-3.pdf?src-supplier=Compliance+Statements; ComponentLink24Description: http://sigma.octopart.com:80/conflict_mineral_statement/Yageo-company-3.pdf?src-supplier=Compliance+Statements; ComponentLink25URL: http://sigma.octopart.com:80/rohs_statement/Yageo-company-2.pdf?src-supplier=Compliance+Statements; ComponentLink25Description: http://sigma.octopart.com:80/rohs_statement/Yageo-company-2.pdf?src-supplier=Compliance+Statements; Supplier 1: DigiKey; Supplier Part Number 1: 311-10.0KHRTR-ND
R?#8 = RG1608N-472-W-T1: Res Thin Film 0603 4.7K Ohm 0.05% 0.1W(1/10W) ±10ppm/C Pad SMD Automotive Medical T/R; Manufacturer: Susumu; Max Power Dissipation: 100mW; Value: 4.7kΩ; Temperature Coefficient: 10ppm/°C; Voltage Rating: 75V; Supplier: DigiKey; Supplier Part Number: RG16N4.7KWDKR-ND; Manufacturer Part Number: RG1608N-472-W-T1; RoHS: Compliant; Category: Chip SMD Resistors; Stock: 5877; Pricing: 1=0.6, 10=0.499, 25=0.4624, 50=0.4368, 100=0.4133, 250=0.38512, 500=0.36608 (USD); Case/Package: 0603; Case Code (Imperial): 0603; Case Code (Metric): 1608; Composition: Metal Film; Country of Origin: Mainland China, Japan; Export Control Classification Number (ECCN) Code: EAR99; Features: Automotive AEC-Q200; Height: 400µm; Harmonized Tariff Schedule (HTS) Code: 8533.21.00.30; Introduction Date: 2006-03-30; Lead Free: Lead Free; Length: 1.6mm; Lifecycle Status: Obsolete; LTB Date: 2011-09-30; LTD Date: 2011-10-31; Max Operating Temperature: 155°C; Min Operating Temperature: -55°C; Mounting Technology: Surface Mount; Number of Terminals: 2; Number of Terminations: 2; Packaging: Cut Tape; Power Rating: 100mW; Schedule B: 8533210045, 8533210045|8533210045|8533210045|8533210045|8533210045; Termination: SMD/SMT; Tolerance: 0.05%; Voltage Rating (DC): 75V; Width: 800µm; Working Voltage: 75V; ComponentLink1URL: https://datasheet.octopart.com:443/RG1608N-472-W-T1-Susumu-datasheet-12510102.pdf?src-supplier=Upverter; ComponentLink1Description: https://datasheet.octopart.com:443/RG1608N-472-W-T1-Susumu-datasheet-12510102.pdf?src-supplier=Upverter; ComponentLink2URL: https://datasheet.octopart.com:443/RG1608N-472-W-T1-Susumu-datasheet-17595413.pdf?src-supplier=IHS; ComponentLink2Description: https://datasheet.octopart.com:443/RG1608N-472-W-T1-Susumu-datasheet-17595413.pdf?src-supplier=IHS; ComponentLink3URL: https://datasheet.octopart.com/RG1608N-472-W-T1-Susumu-datasheet-12509734.pdf; ComponentLink3Description: https://datasheet.octopart.com/RG1608N-472-W-T1-Susumu-datasheet-12509734.pdf; ComponentLink4URL: https://datasheet.octopart.com:443/RG1608N-472-W-T1-Susumu-datasheet-118552.pdf?src-supplier=DigiKey; ComponentLink4Description: https://datasheet.octopart.com:443/RG1608N-472-W-T1-Susumu-datasheet-118552.pdf?src-supplier=DigiKey; Supplier 1: DigiKey; Supplier Part Number 1: RG16N4.7KWDKR-ND
U? = TPS53319DQPR: 1.5-V to 22-V, 14-A synchronous buck converter with eco-mode 22-LSON-CLIP -40 to 125; Manufacturer: Texas Instruments; Manufacturer Lifecycle Status: ACTIVE; Efficiency: 91%; Max Supply Voltage: 22V; Max Junction Temperature (Tj): 125°C; Max Output current: 14A; Max Output Voltage: 5.5V; Min Input Voltage: 1.5V; Min Output Voltage: 600mV; Nominal Supply Current: 420µA; Number of Outputs: 1; Output Configuration: Positive; Output Type: Adjustable; Quiescent Current: 320µA; Switching Frequency: 1MHz; Synchronous Rectifier: Yes; Supplier: DigiKey; Supplier Part Number: 296-39409-6-ND; Manufacturer Part Number: TPS53319DQPR; RoHS: Compliant; Category: Voltage Regulators - Switching; Stock: 4528; Pricing: 1=8.17, 10=6.326, 25=5.8648, 100=5.3574, 250=5.22648 (USD); Ambient Temperature Range High: 85°C; Contact Plating: Gold; Height: 1.5mm; Lead Free: Contains Lead; Length: 6mm; Lifecycle Status: Production; Max Operating Temperature: 85°C; Min Operating Temperature: -40°C; Min Supply Voltage: 1.5V; Mounting Technology: Surface Mount; Pins: 22; Output Current: 14A; Output Voltage: 5.5V; Packaging: Tape and Reel; Radiation Hardening: No; Schedule B: 8542390000, 8542390000|8542390000|8542390000|8542390000|8542390000; Thickness: 1.5mm; Topology: Buck; Width: 5mm; ComponentLink1URL: https://octopart.com:443/opatz8j6/c1?t=AL0UYSoI0wy8P97GosR9xrHUjte7L0Qo2-x4AmHoIy7ffP5vG_O73v4P7Qp22pCdP8FGf4tBQ1mR7pZBPgKgCjwNC9TSRhmN8eBHcUZ6Qse-4jciZLAlL4yh0sUxw6hK2wjCfMg-fcT9ZTP3q_5slqkOiKMHf2QuZLrS8qOrHaTqAXm8URBonXHShlHcY_9JW_UbEj3BLH_4AM8R0zIbrlZ4vYZkteZ4JX-JD4VzZp0NEqG6N4FuZcECKTj5iISTyACMSHq2jgZPJts0gi1ZlRYwlUvBazFyMcr3Z4-IId-7yxx4V3WvVaFk1slvgPu2KYE66fMtLnomQbcPc8wZjJzFaZCEHMQ5AH6TAB1sRiqZqDKDNfnQpzO_fEGnUlXyaosEjUQ&src-supplier=Texas+Instruments; ComponentLink1Description: https://octopart.com:443/opatz8j6/c1?t=AL0UYSoI0wy8P97GosR9xrHUjte7L0Qo2-x4AmHoIy7ffP5vG_O73v4P7Qp22pCdP8FGf4tBQ1mR7pZBPgKgCjwNC9TSRhmN8eBHcUZ6Qse-4jciZLAlL4yh0sUxw6hK2wjCfMg-fcT9ZTP3q_5slqkOiKMHf2QuZLrS8qOrHaTqAXm8URBonXHShlHcY_9JW_UbEj3BLH_4AM8R0zIbrlZ4vYZkteZ4JX-JD4VzZp0NEqG6N4FuZcECKTj5iISTyACMSHq2jgZPJts0gi1ZlRYwlUvBazFyMcr3Z4-IId-7yxx4V3WvVaFk1slvgPu2KYE66fMtLnomQbcPc8wZjJzFaZCEHMQ5AH6TAB1sRiqZqDKDNfnQpzO_fEGnUlXyaosEjUQ&src-supplier=Texas+Instruments; ComponentLink2URL: https://datasheet.octopart.com:443/TPS53319DQPR-Texas-Instruments-datasheet-38175576.pdf?src-supplier=Texas+Instruments; ComponentLink2Description: https://datasheet.octopart.com:443/TPS53319DQPR-Texas-Instruments-datasheet-38175576.pdf?src-supplier=Texas+Instruments; ComponentLink3URL: https://datasheet.octopart.com:443/TPS53319DQPR-Texas-Instruments-datasheet-34154633.pdf?src-supplier=Texas+Instruments; ComponentLink3Description: https://datasheet.octopart.com:443/TPS53319DQPR-Texas-Instruments-datasheet-34154633.pdf?src-supplier=Texas+Instruments; ComponentLink4URL: https://datasheet.octopart.com:443/TPS53319DQPR-Texas-Instruments-datasheet-15761990.pdf?src-supplier=Texas+Instruments; ComponentLink4Description: https://datasheet.octopart.com:443/TPS53319DQPR-Texas-Instruments-datasheet-15761990.pdf?src-supplier=Texas+Instruments; ComponentLink5URL: https://datasheet.octopart.com:443/TPS53319DQPR-Texas-Instruments-datasheet-12082334.pdf?src-supplier=Texas+Instruments; ComponentLink5Description: https://datasheet.octopart.com:443/TPS53319DQPR-Texas-Instruments-datasheet-12082334.pdf?src-supplier=Texas+Instruments; ComponentLink6URL: https://datasheet.octopart.com:443/TPS53319DQPR-Texas-Instruments-datasheet-11525761.pdf?src-supplier=Texas+Instruments; ComponentLink6Description: https://datasheet.octopart.com:443/TPS53319DQPR-Texas-Instruments-datasheet-11525761.pdf?src-supplier=Texas+Instruments; ComponentLink7URL: https://sigma.octopart.com:443/49251923/technical_drawing/Texas-Instruments-TPS53319DQPR.pdf?src-supplier=Texas+Instruments; ComponentLink7Description: https://sigma.octopart.com:443/49251923/technical_drawing/Texas-Instruments-TPS53319DQPR.pdf?src-supplier=Texas+Instruments; ComponentLink8URL: https://datasheet.octopart.com:443/TPS53319DQPR-Texas-Instruments-datasheet-150455030.pdf?src-supplier=Upverter; ComponentLink8Description: https://datasheet.octopart.com:443/TPS53319DQPR-Texas-Instruments-datasheet-150455030.pdf?src-supplier=Upverter; ComponentLink9URL: https://datasheet.octopart.com:443/TPS53319DQPR-Texas-Instruments-datasheet-160672347.pdf?src-supplier=LCSC; ComponentLink9Description: https://datasheet.octopart.com:443/TPS53319DQPR-Texas-Instruments-datasheet-160672347.pdf?src-supplier=LCSC; ComponentLink10URL: http://sigma.octopart.com:80/reach_statement/Texas-Instruments-company-64.pdf?src-supplier=Compliance+Statements; ComponentLink10Description: http://sigma.octopart.com:80/reach_statement/Texas-Instruments-company-64.pdf?src-supplier=Compliance+Statements; ComponentLink11URL: http://sigma.octopart.com:80/conflict_mineral_statement/Texas-Instruments-company-63.pdf?src-supplier=Compliance+Statements; ComponentLink11Description: http://sigma.octopart.com:80/conflict_mineral_statement/Texas-Instruments-company-63.pdf?src-supplier=Compliance+Statements; Supplier 1: DigiKey; Supplier Part Number 1: 296-39409-6-ND